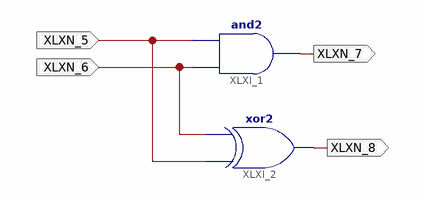
[diagram p0: schematic sheet 1]
// Xilinx ISE schematic HalfAdder.sch (spartan6) as structural Verilog: 2 symbols, 4 ports
module HalfAdder (
  input  XLXN_5,
  input  XLXN_6,
  output XLXN_7,
  output XLXN_8
);

  and XLXI_1 (XLXN_7, XLXN_6, XLXN_5);
  xor XLXI_2 (XLXN_8, XLXN_5, XLXN_6);
endmodule
